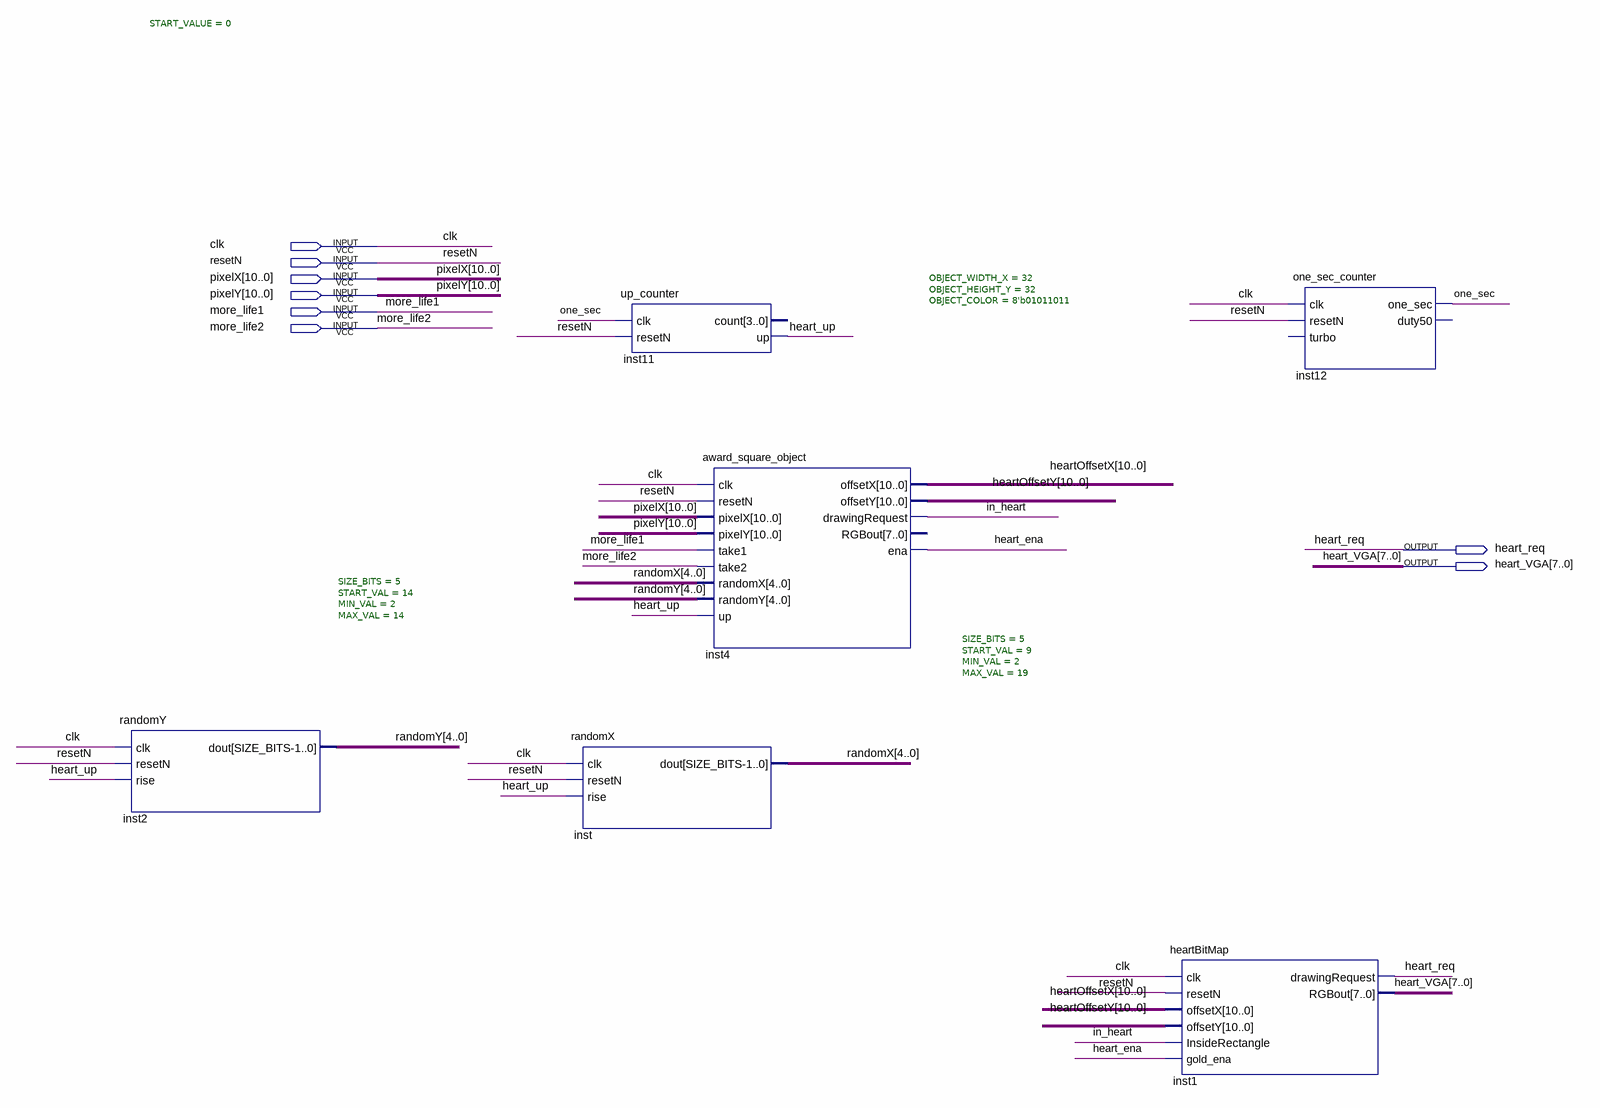
[diagram p0: schematic sheet]
// Quartus schematic heart.bdf as structural Verilog: 6 symbols, 8 pins
module heart (
  input  clk,
  input  resetN,
  input  [10:0] pixelX,
  input  [10:0] pixelY,
  input  more_life1,
  input  more_life2,
  output heart_req,
  output [7:0] heart_VGA
);

  wire heart_ena, heart_up, in_heart, one_sec;
  wire [4:0] randomX, randomY;
  wire [10:0] heartOffsetX, heartOffsetY;

  randomY #(.SIZE_BITS(5), .START_VAL(14), .MIN_VAL(2), .MAX_VAL(14)) inst2 (
    .clk(clk), .resetN(resetN), .rise(heart_up), .dout(randomY));
  randomX #(.SIZE_BITS(5), .START_VAL(9), .MIN_VAL(2), .MAX_VAL(19)) inst (
    .clk(clk), .resetN(resetN), .rise(heart_up), .dout(randomX));
  up_counter #(.START_VALUE(0)) inst11 (.clk(one_sec), .resetN(resetN), .up(heart_up));  // open: count
  award_square_object #(.OBJECT_WIDTH_X(32), .OBJECT_HEIGHT_Y(32), .OBJECT_COLOR(8'b01011011)) inst4 (
    .clk(clk), .resetN(resetN), .pixelX(pixelX), .pixelY(pixelY), .take1(more_life1), .take2(more_life2),
    .randomX(randomX), .randomY(randomY), .up(heart_up), .offsetX(heartOffsetX), .offsetY(heartOffsetY),
    .drawingRequest(in_heart), .ena(heart_ena));  // open: RGBout
  heartBitMap inst1 (
    .clk(clk), .resetN(resetN), .offsetX(heartOffsetX), .offsetY(heartOffsetY), .InsideRectangle(in_heart),
    .gold_ena(heart_ena), .drawingRequest(heart_req), .RGBout(heart_VGA));
  one_sec_counter inst12 (.clk(clk), .resetN(resetN), .one_sec(one_sec));  // open: turbo, duty50
endmodule
